# Altium project Torque_sensor.PrjPcb
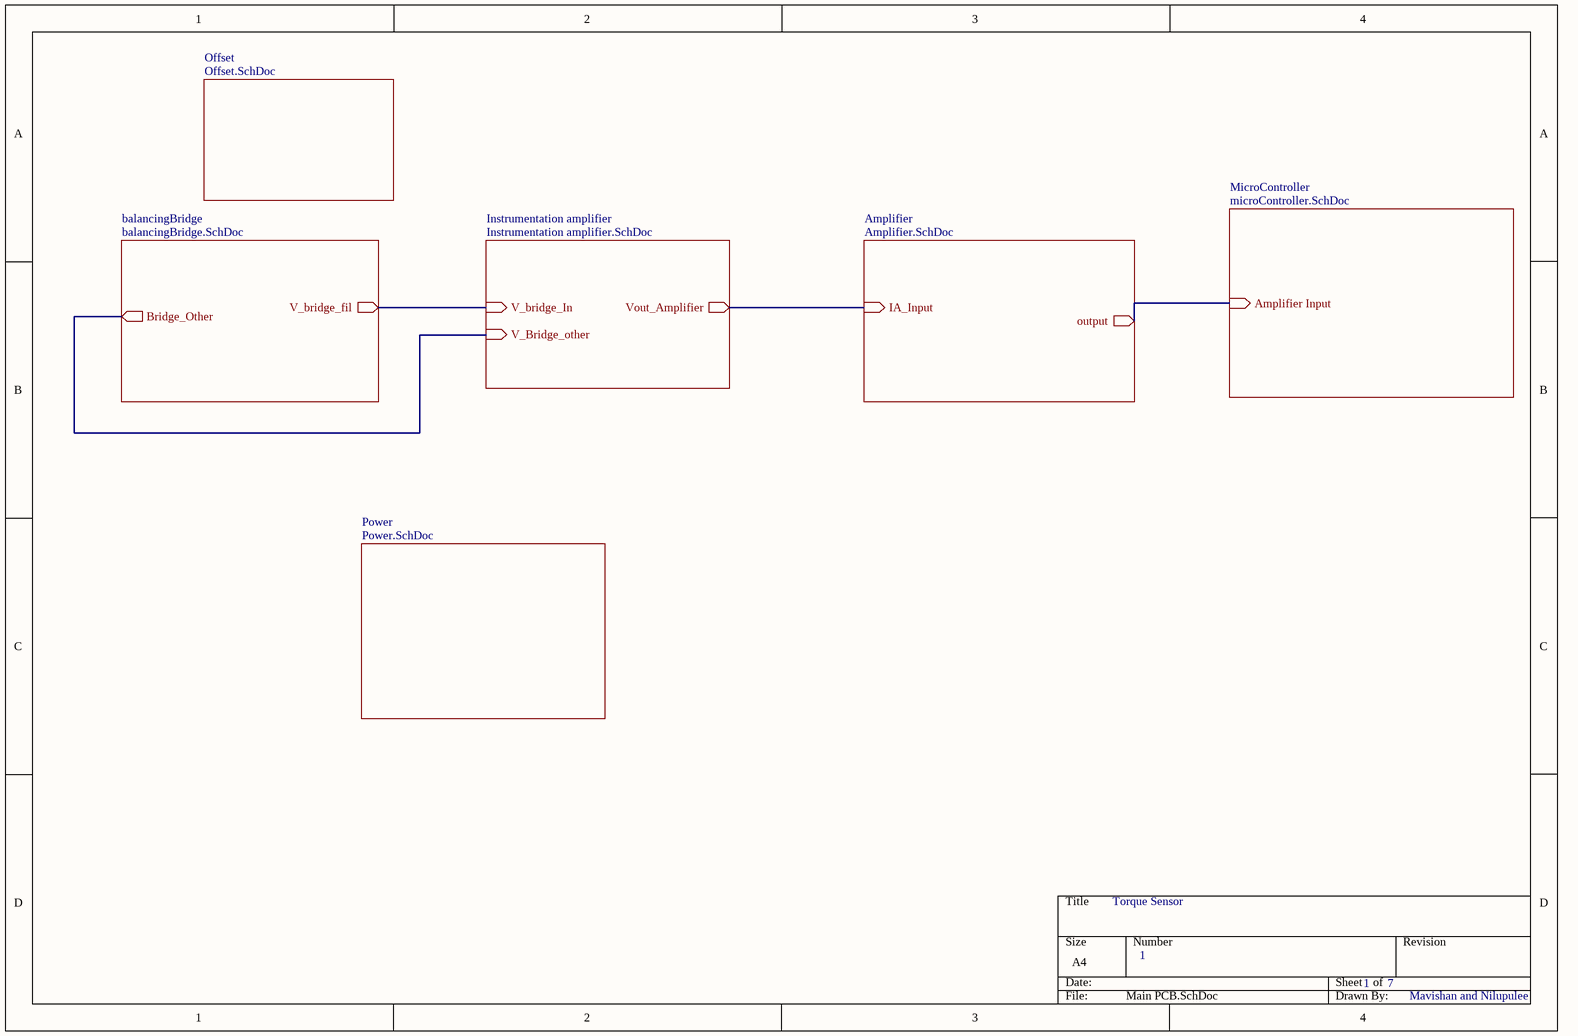
[diagram p0: Main PCB.SchDoc]
7 sheets, 47 parts. Net scope: hierarchical (ports join the sheet entries above them; power ports are global).
Board file: PCB2.PcbDoc
Sheets:
  Main PCB.SchDoc
    balancingBridge = balancingBridge.SchDoc
    Instrumentation amplifier = Instrumentation amplifier.SchDoc
    Amplifier = Amplifier.SchDoc
    MicroController = microController.SchDoc
    Power = Power.SchDoc
    Offset = Offset.SchDoc

## Sheet Main PCB.SchDoc
size A4; SheetNumber: 1; SheetTotal: 7; SPICEModelCacheBXTNJVLD: <root> / <DocumentId>BXTNJVLD</DocumentId> / </root>

### Sub-sheets
Amplifier = Amplifier.SchDoc: IA_Input (in), output (out)
balancingBridge = balancingBridge.SchDoc: V_bridge_fil (out), Bridge_Other (out)
Instrumentation amplifier = Instrumentation amplifier.SchDoc: V_bridge_In (in), Vout_Amplifier (out), V_Bridge_other (in)
MicroController = microController.SchDoc: Amplifier Input (in)
Offset = Offset.SchDoc: no entries
Power = Power.SchDoc: no entries

### Nets
Amplifier Input: sheet Amplifier/output, sheet MicroController/Amplifier Input
Bridge_Other: sheet balancingBridge/Bridge_Other, sheet Instrumentation amplifier/V_Bridge_other
IA_Input: sheet Instrumentation amplifier/Vout_Amplifier, sheet Amplifier/IA_Input
V_bridge_fil: sheet balancingBridge/V_bridge_fil, sheet Instrumentation amplifier/V_bridge_In

### Notes on the sheet
- Torque Sensor
- 1
- 7
- Mavishan and Nilupulee

## Sheet balancingBridge.SchDoc
size A4; SheetNumber: 2; SheetTotal: 7
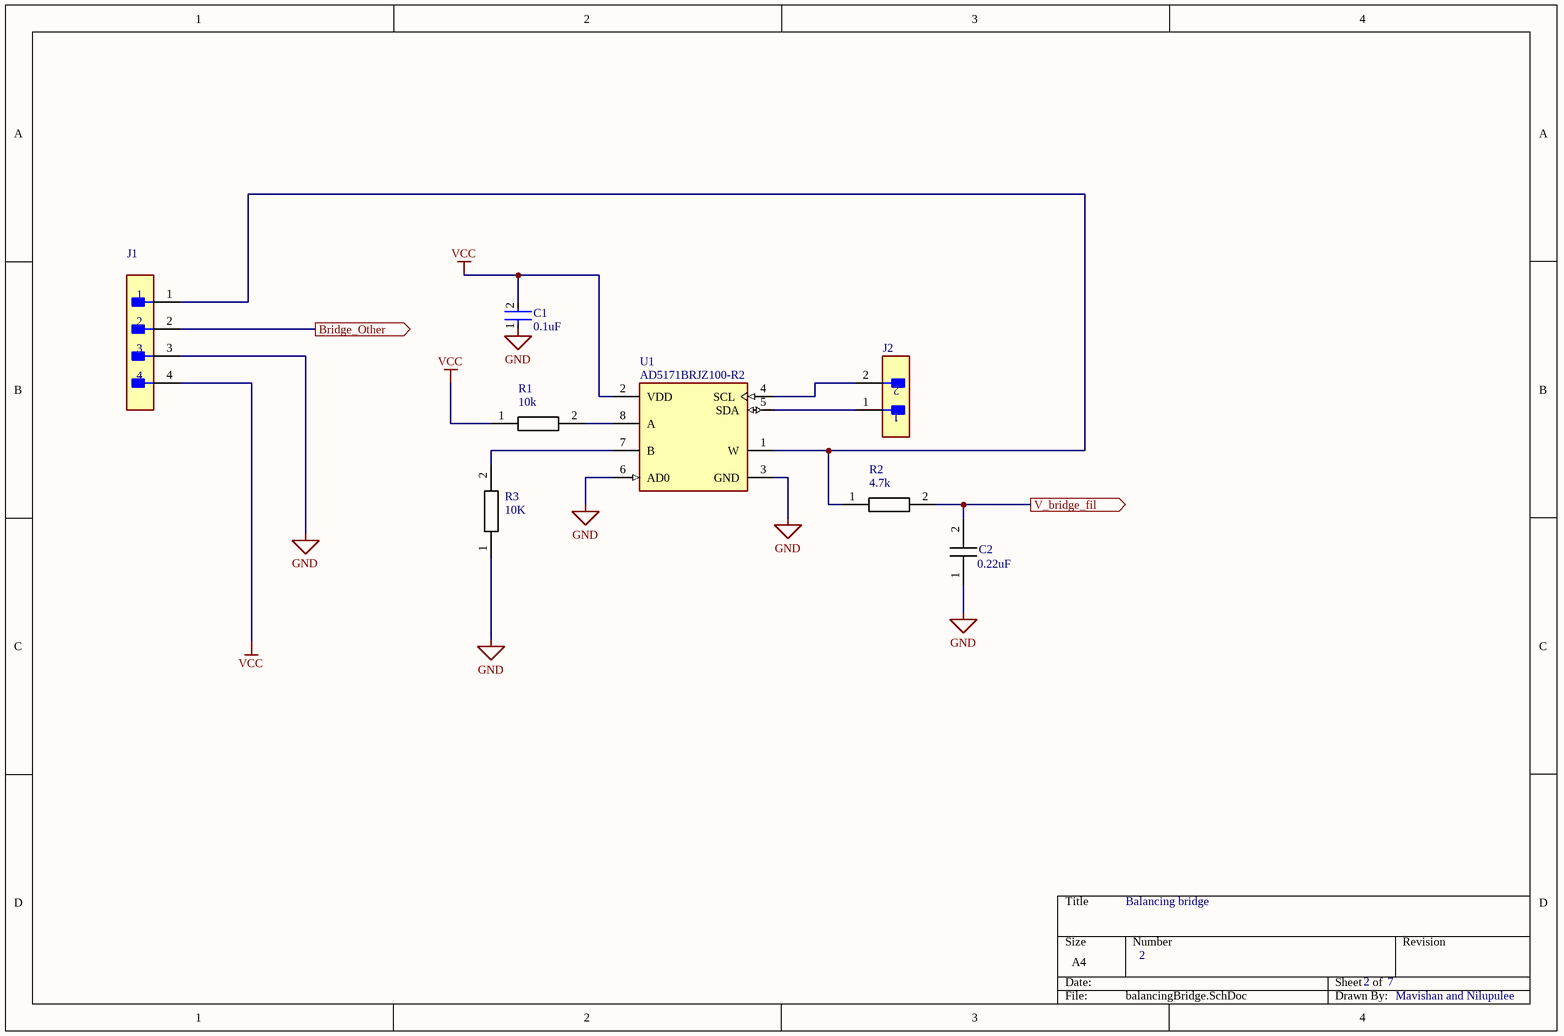
[diagram p1: balancingBridge.SchDoc]

### Parts
C1  0.1uF  [FP-C1206C-EB-MFG]
C2  Parameter 1: 0.22uF  [CAPC3216X94N]  (hidden comment: 12063C224JAT2A)
J1  B4B-XH-A(LF)(SN)  [FP-B4B-XH-A_LF_SN-MFG]  (value not drawn)
J2  M20-9990246  [FP-M20-9990246-MFG]  (value not drawn)
R1  Parameter 1: 10k  [RESC3216X70N]  (hidden comment: ERA-8AEB103V)
R2  Parameter 1: 4.7k  [RESC3116X65N]  (hidden comment: CHP1206AFX-4701ELF)
R3  Parameter 1: 10K  [RESC3216X70N]  (hidden comment: ERA-8AEB103V)
U1  AD5171BRJZ100-R2  [FP-RJ-8-IPC_A]

### Ports
Bridge_Other (out, see Main PCB[2B]), V_bridge_fil (out, see Main PCB[2B])

### Nets
GND: C1.1 C2.1(C1) J1.3 R3.1 U1.3(GND) U1.6(AD0)
VCC: C1.2 J1.4 R1.1 U1.2(VDD)
Bridge_Other: J1.2 ; port Bridge_Other
V_bridge_fil: C2.2(C2) R2.2 ; port V_bridge_fil
NetJ1_1: J1.1 R2.1 U1.1(W)
NetJ2_1: J2.1 U1.5(SDA)
NetJ2_2: J2.2 U1.4(SCL)
NetR1_2: R1.2 U1.8(A)
NetR3_2: R3.2 U1.7(B)

### Notes on the sheet
- Balancing bridge
- 2
- 7
- Mavishan and Nilupulee

### Library data of the parts
C1 = CMP-1037-04186-2: CAP CER 0.1UF 25V C0G/NP0 1206; Manufacturer: KEMET; Manufacturer Part Number: C1206C104F3GACTU; Material: Ceramic; Value: 0.10 μF; Temperature Characteristic: C0G; Temperature Coefficient: 15%; Tolerance: 0.01; Automotive Grade: Grade 0; Device Class L3: Ceramic Capacitors; Voltage Rating: 25 V; Temperature Range Low: -55°C; RoHS: TRUE; Package: C1206C-EB; Category: Cap; Lead Free: Yes; ComponentLink2URL: https://content.kemet.com/datasheets/KEM_C1007_X8R_ULTRA_150C_SMD.pdf; Ipc Land Pattern Name: CAPC320160X78; Temperature Range High: +150°C; Height: 0.88mm; Digikey Description: CAP CER 0.1UF 25V C0G/NP0 1206; ComponentLink2Description: Datasheet; Capacitance: 0.10 μF; Mouser Description: Multilayer Ceramic Capacitors MLCC - SMD/SMT 25volts 0.1uF 1% C0G; Octopart: https://octopart.com/c1206c104f3gactu-kemet-13149870; Device Class L1: Passive Components; Device Class L2: Capacitors; Automotive: Yes; Temperature: -55°C to +150°C
C2 = 12063C224JAT2A: Capacitor; Manufacturer_Name: Kyocera AVX; Manufacturer_Part_Number: 12063C224JAT2A; Mouser Part Number: 581-12063C224JAT2A; Arrow Part Number: 12063C224JAT2A; Arrow Price/Stock: https://www.arrow.com/en/products/12063c224jat2a/avx
J1 = CMP-17439-000250-1: CONN HEADER VERT 4POS 2.5MM; Number of Contacts: 4; Contact Resistance: 20mR; Voltage Rating: 250V; Max Current Rating: 3A; Gender: Male; Wire/Cable Gauge: 22AWG; Mated Stacking Heights: 9.8mm; Insulation Resistance: 1GR; Orientation: Straight; Contact Type: Male Pin; Contact Finish - Mating: TIN; Series: XH; Max Voltage Rating (AC): 250V; Lead Pitch: 2.5mm; Contact Shape: Square; Insulation Color: Natural; Termination: Solder; Lead Free: Lead Free; Voltage Rating (AC): 250V; Number of Rows: 1; Flammability Rating: UL94 V-0; Number of Positions: 4; Max Operating Temperature: 85°C; Package Quantity: 500; Mount: Through Hole; REACH SVHC: No SVHC; Connector Type: Header; Insulation Material: Nylon; Fastening Type: Detent; Min Operating Temperature: -25°C; Housing Color: White; Packaging: Bulk; Contact Plating: Tin; Contact Material: Brass; Max Voltage Rating (DC): 250V; Housing Material: Polyamide; Color: Natural; Material: Polyamide; Pitch: 2.5mm; Depth: 5.75mm; Current Rating: 3A; Length: 12.4mm
J2 = CMP-15831-000009-1: CONN HEADER VERT 2POS 2.54MM; Manufacturer: Harwin; Conn Gender: Male; Conn Orientation: Vertical; Number Of Contacts: 2; Current Rating: 3A; ComponentLink2URL: https://cdn.harwin.com/pdfs/M20-999.pdf; ComponentLink2Description: Datasheet; Package: M20-9990246; Temperature: -40°C to +105°C; Octopart: https://octopart.com/m20-9990246-harwin-2590635; Mouser Description: 2.54mm (0.1") Pitch SIL Vertical PC Tail Pin Header, 6.1mm mating pin height, tin, 2 contacts; Temperature Range High: +105°C; Device Class L1: Connectors; RoHS: TRUE; Automotive: No; Height: 8.99mm; Number Of Rows: 1; Contact Material: Tin,Nickel; Category: Conn; Pitch: 2.54mm; Lead Free: Yes; Digikey Description: CONN HEADER VERT 2POS 2.54MM; Manufacturer Part Number: M20-9990246; Temperature Range Low: -40°C; Device Class L3: unset; Device Class L2: Headers and Wire Housings
R1 R3 = ERA-8AEB103V: Resistor; Manufacturer_Name: Panasonic; Datasheet Link: https://industrial.panasonic.com/cdbs/www-data/pdf/RDM0000/AOA0000C307.pdf; Height: 0.7mm; Manufacturer_Part_Number: ERA-8AEB103V; Mouser Part Number: 667-ERA-8AEB103V; Mouser Price/Stock: https://www.mouser.co.uk/ProductDetail/Panasonic/ERA-8AEB103V?qs=Ojoo2rCVP9QscDrGu5R0Gw%3D%3D; Arrow Part Number: ERA-8AEB103V; Arrow Price/Stock: https://www.arrow.com/en/products/era8aeb103v/panasonic?region=europe
R2 = CHP1206AFX-4701ELF: Resistor; Manufacturer_Name: Bourns; Datasheet Link: https://www.mouser.be/datasheet/2/54/chp-a-1858677.pdf; Height: 0.65mm; Manufacturer_Part_Number: CHP1206AFX-4701ELF; Mouser Part Number: 652-CHP1206AFX-4701L; Mouser Price/Stock: https://www.mouser.co.uk/ProductDetail/Bourns/CHP1206AFX-4701ELF?qs=GedFDFLaBXHtzjpWW2eupA%3D%3D
U1 = CMP-00026-00446399-1: AD5171BRJZ100-R2 Digital Potentiometer 64POS 100kOhm Single Automotive 8-Pin SOT-23 T/R; Manufacturer Lifecycle Status: PRODUCTION; NexarPartId: 446399; -3db Bandwidth: 1.5MHz; Operating Supply Current: 4µA; Temperature Coefficient: 35ppm/°C; Number of Circuits: 1; Tolerance: 30%; Number of Taps: 64; Max Supply Voltage: 5.5V; Interface: I2C; Resistance: 100kΩ; Frequency: 400kHz; Max Junction Temperature (Tj): 150°C; Min Supply Voltage: 2.7V; Memory Type: Non-Volatile, Volatile; Width: 1.6mm; Lead Free: Contains Lead; Case/Package: SOT-23; Quiescent Current: 4µA; RoHS: Compliant; Taper: Linear; Min Operating Temperature: -40°C; Length: 2.9mm; Height: 1.3mm; Lifecycle Status: Production; Packaging: Cut Tape; Number of Pins: 8; REACH SVHC: No SVHC; Contact Plating: Gold; Nominal Supply Current: 4µA; Max Operating Temperature: 125°C; Number of Elements: 1; Mount: Surface Mount; Max Supply Current: 4µA; Schedule B: 8542390000, 8542390000; Number of Positions: 64; Operating Supply Voltage: 5.5V

## Sheet Instrumentation amplifier.SchDoc
size A4; SheetNumber: 3; SheetTotal: 7
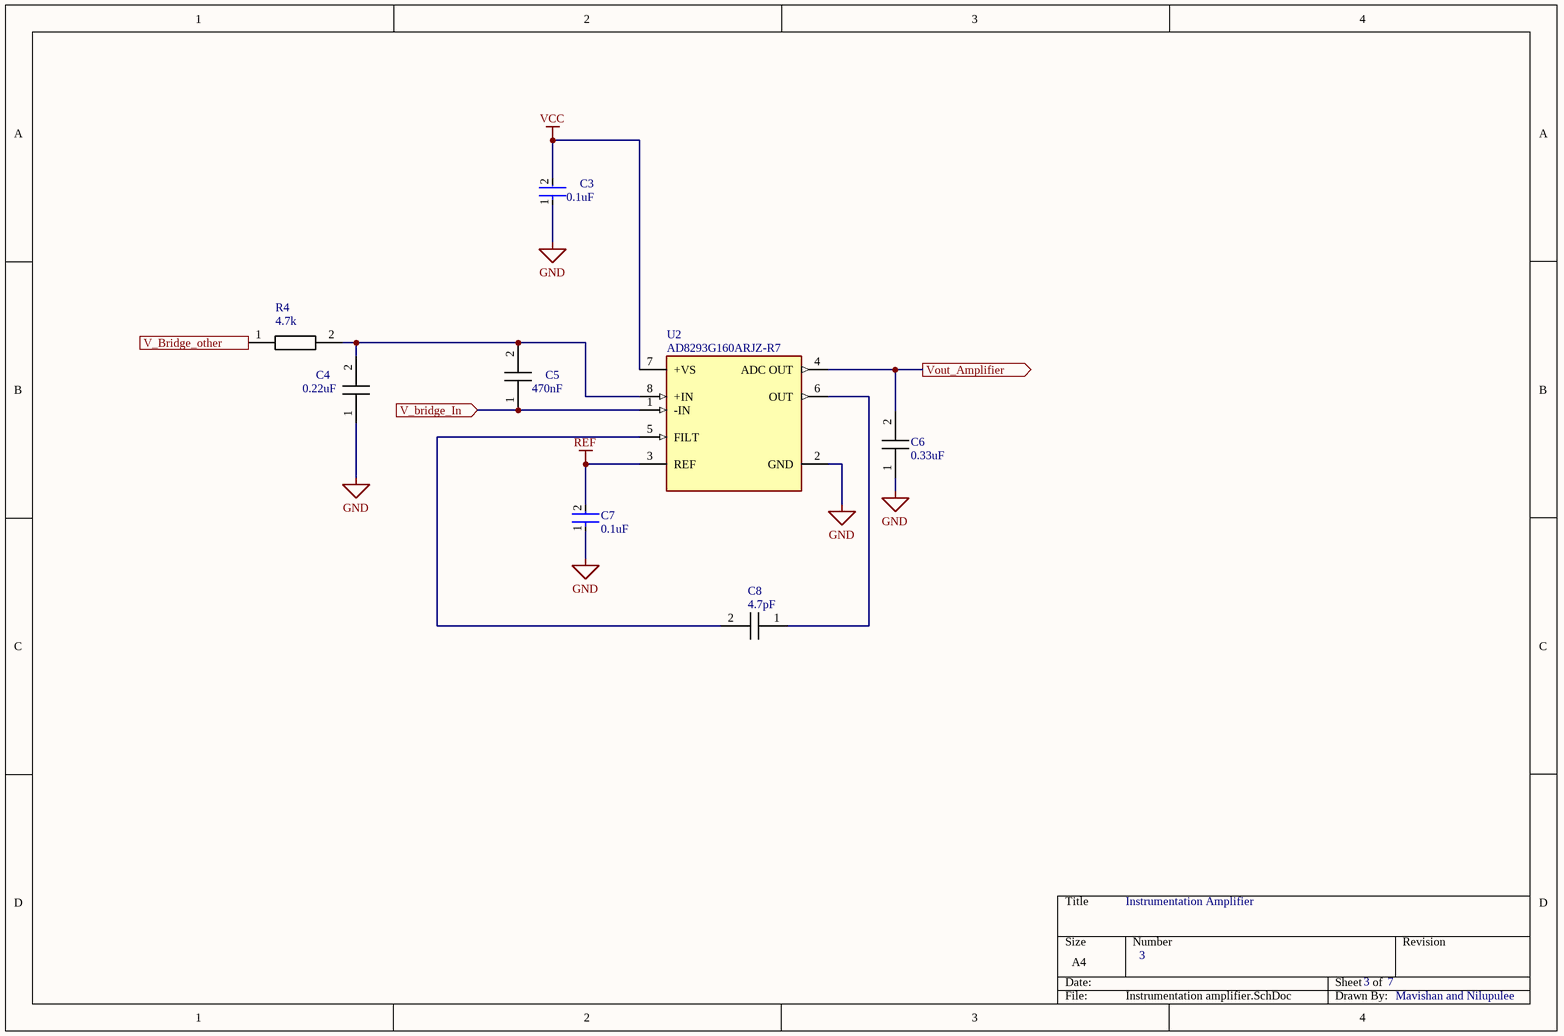
[diagram p2: Instrumentation amplifier.SchDoc]

### Parts
C3  0.1uF  [FP-C1206C-EB-MFG]
C4  Parameter 1: 0.22uF  [CAPC3216X94N]  (hidden comment: 12063C224JAT2A)
C5  Parameter 1: 470nF  [CAPC3216X152N]  (hidden comment: 12065C474JAT2A)
C6  Parameter 1: 0.33uF  [CAPC3216X127N]  (hidden comment: 12063C334MAT2A)
C7  0.1uF  [FP-C1206C-EB-MFG]
C8  Parameter 1: 4.7pF  [CAPC3216X94N]  (hidden comment: 12063A4R7DAT2A)
R4  Parameter 1: 4.7k  [RESC3116X65N]  (hidden comment: CHP1206AFX-4701ELF)
U2  AD8293G160ARJZ-R7  [FP-RJ-8-IPC_B]

### Ports
V_bridge_In (in, see Main PCB[2B]), V_Bridge_other (in, see Main PCB[2B]), Vout_Amplifier (out, see Main PCB[2B])

### Nets
GND: C3.1 C4.1(C1) C6.1(C1) C7.1 U2.2(GND)
REF: C7.2 U2.3(REF)
VCC: C3.2 U2.7(+VS)
Bridge_Other: R4.1 ; port V_Bridge_other
IA_Input: C6.2(C2) U2.4(ADC_OUT) ; port Vout_Amplifier
V_bridge_fil: C5.1 U2.1(-IN) ; port V_bridge_In
NetC4_2: C4.2(C2) C5.2 R4.2 U2.8(+IN)
NetC8_1: C8.1 U2.6(OUT)
NetC8_2: C8.2 U2.5(FILT)

### Notes on the sheet
- Instrumentation Amplifier
- 3
- 7
- Mavishan and Nilupulee

### Library data of the parts
C3 C7 = CMP-1037-04186-2: as C1 on sheet balancingBridge; Device Class L3: Ceramic Capacitors; Voltage Rating: 25 V; Temperature Range Low: -55°C; RoHS: TRUE; Package: C1206C-EB; Category: Cap; Lead Free: Yes; ComponentLink2URL: https://content.kemet.com/datasheets/KEM_C1007_X8R_ULTRA_150C_SMD.pdf; Ipc Land Pattern Name: CAPC320160X78; Temperature Range High: +150°C; Height: 0.88mm; Digikey Description: CAP CER 0.1UF 25V C0G/NP0 1206; ComponentLink2Description: Datasheet; Capacitance: 0.10 μF; Mouser Description: Multilayer Ceramic Capacitors MLCC - SMD/SMT 25volts 0.1uF 1% C0G; Octopart: https://octopart.com/c1206c104f3gactu-kemet-13149870; Device Class L1: Passive Components; Device Class L2: Capacitors; Automotive: Yes; Temperature: -55°C to +150°C
C4 = 12063C224JAT2A: as C2 on sheet balancingBridge; Manufacturer_Part_Number: 12063C224JAT2A; Mouser Part Number: 581-12063C224JAT2A; Arrow Part Number: 12063C224JAT2A; Arrow Price/Stock: https://www.arrow.com/en/products/12063c224jat2a/avx
C5 = 12065C474JAT2A: Capacitor; Manufacturer_Name: Kyocera AVX; Datasheet Link: https://spicat.kyocera-avx.com/product/mlcc/chartview/12065C474JAT2A/DataSheet/X7R; Height: 1.52mm; Manufacturer_Part_Number: 12065C474JAT2A; Mouser Part Number: 581-12065C474J; Mouser Price/Stock: https://www.mouser.co.uk/ProductDetail/AVX/12065C474JAT2A?qs=JKNO%252BtokWhWmgS3PHs6ZAg%3D%3D; as: *
C6 = 12063C334MAT2A: Capacitor; Manufacturer_Name: Kyocera AVX; Manufacturer_Part_Number: 12063C334MAT2A; Mouser Part Number: 581-12063C334MAT2A; Mouser Price/Stock: https://www.mouser.co.uk/ProductDetail/AVX/12063C334MAT2A?qs=UY55afH%252BLTTA4%2F7p5aIkng%3D%3D
C8 = 12063A4R7DAT2A: Capacitor; Manufacturer_Name: Kyocera AVX; Datasheet Link: https://spicat.kyocera-avx.com/product/mlcc/chartview/12063A4R7DAT2A/DataSheet/NP0; Height: 0.94mm; Manufacturer_Part_Number: 12063A4R7DAT2A; Mouser Part Number: 581-12063A4R7DAT2A; Mouser Price/Stock: https://www.mouser.com/Search/Refine.aspx?Keyword=581-12063A4R7DAT2A
R4 = CHP1206AFX-4701ELF: Resistor; Manufacturer_Name: Bourns; Datasheet Link: https://www.mouser.be/datasheet/2/54/chp-a-1858677.pdf; Height: 0.65mm; Manufacturer_Part_Number: CHP1206AFX-4701ELF; Mouser Part Number: 652-CHP1206AFX-4701L; Mouser Price/Stock: https://www.mouser.co.uk/ProductDetail/Bourns/CHP1206AFX-4701ELF?qs=GedFDFLaBXHtzjpWW2eupA%3D%3D
U2 = CMP-09116-000116-1: IC INST AMP 1 CIRCUIT SOT23-8; Output Current per Channel: 35mA; -3db Bandwidth: 500Hz; Max Supply Voltage: 5.5V; Number of Circuits: 1; Input Resistance: 10GR; Power Supply Rejection Ratio (PSRR): 94dB; Input Offset Voltage (Vos): 50uV; Input Bias Current: 2nA; Min Supply Voltage: 1.8V; Amplifier Type: INSTRUMENTATION AMPLIFIER; Common Mode Rejection Ratio: 140dB; Max Supply Current: 1.5mA; Operating Supply Current: 1.3mA; Min Operating Temperature: -40°C; Length: 2.9mm; Packaging: Tape and Reel; Case/Package: SOT; Series: -; Height: 1.3mm; Number of Amplifiers: 1; REACH SVHC: No SVHC; Number of Elements: 1; Lead Free: Contains Lead; Gain Bandwidth Product: 500Hz; Number of Channels: 1; Number of Pins: 8; Mount: Surface Mount; Package Quantity: 3000; Width: 1.6mm; Contact Plating: Gold; RoHS Compliant: Yes; Max Operating Temperature: 85°C

## Sheet Amplifier.SchDoc
size A4; SheetNumber: 4; SheetTotal: 7
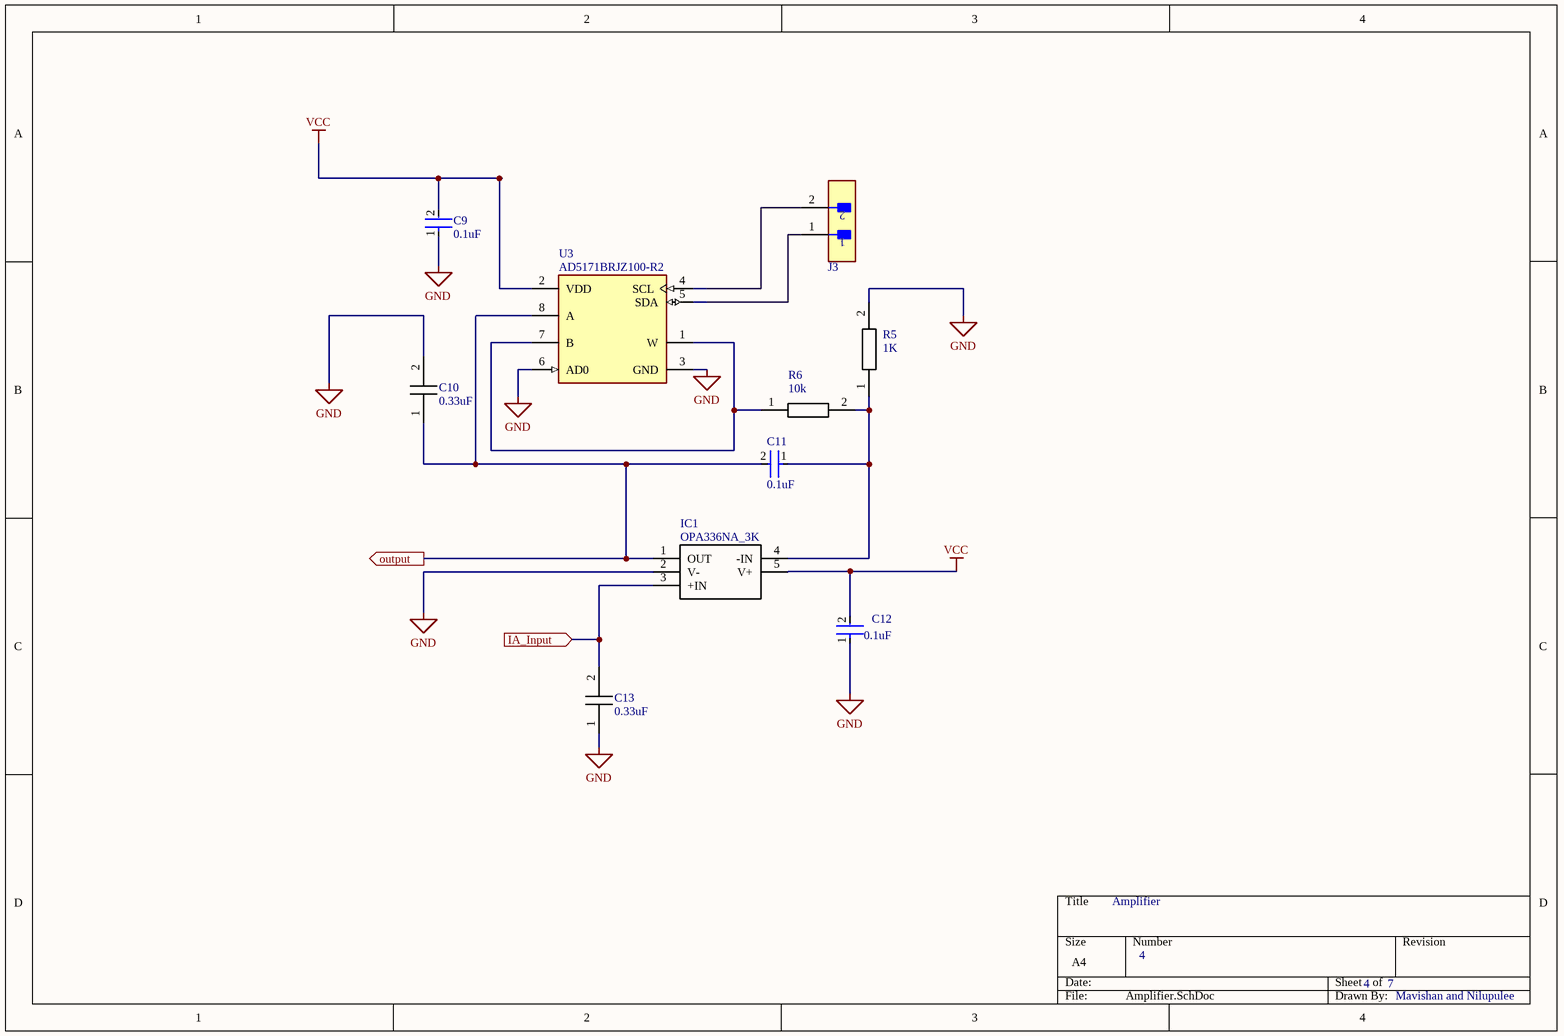
[diagram p3: Amplifier.SchDoc]

### Parts
C9  0.1uF  [FP-C1206C-EB-MFG]
C10  Parameter 1: 0.33uF  [CAPC3216X127N]  (hidden comment: 12063C334MAT2A)
C11  0.1uF  [FP-C1206C-EB-MFG]
C12  0.1uF  [FP-C1206C-EB-MFG]
C13  Parameter 1: 0.33uF  [CAPC3216X127N]  (hidden comment: 12063C334MAT2A)
IC1  OPA336NA_3K  [SOT95P280X145-5N]
J3  M20-9990246  [FP-M20-9990246-MFG]  (value not drawn)
R5  Parameter 1: 1K  [RESC3216X70N]  (hidden comment: ERA8AEB102V)
R6  Parameter 1: 10k  [RESC3216X70N]  (hidden comment: ERA-8AEB103V)
U3  AD5171BRJZ100-R2  [FP-RJ-8-IPC_A]

### Ports
IA_Input (in, see Main PCB[3B]), output (out, see Main PCB[3B])

### Nets
GND: C9.1 C10.2(C2) C12.1 C13.1(C1) IC1.2(V-) R5.2 U3.3(GND) U3.6(AD0)
VCC: C9.2 C12.2 IC1.5(V+) U3.2(VDD)
Amplifier Input: C10.1(C1) C11.2 IC1.1(OUT) U3.8(A) ; port output
IA_Input: C13.2(C2) IC1.3(+IN) ; port IA_Input
NetC11_1: C11.1 IC1.4(-IN) R5.1 R6.2
NetJ3_1: J3.1 U3.5(SDA)
NetJ3_2: J3.2 U3.4(SCL)
NetR6_1: R6.1 U3.1(W) U3.7(B)

### Notes on the sheet
- Amplifier
- 4
- 7
- Mavishan and Nilupulee

### Library data of the parts
C9 C11 C12 = CMP-1037-04186-2: as C1 on sheet balancingBridge; Device Class L3: Ceramic Capacitors; Voltage Rating: 25 V; Temperature Range Low: -55°C; RoHS: TRUE; Package: C1206C-EB; Category: Cap; Lead Free: Yes; ComponentLink2URL: https://content.kemet.com/datasheets/KEM_C1007_X8R_ULTRA_150C_SMD.pdf; Ipc Land Pattern Name: CAPC320160X78; Temperature Range High: +150°C; Height: 0.88mm; Digikey Description: CAP CER 0.1UF 25V C0G/NP0 1206; ComponentLink2Description: Datasheet; Capacitance: 0.10 μF; Mouser Description: Multilayer Ceramic Capacitors MLCC - SMD/SMT 25volts 0.1uF 1% C0G; Octopart: https://octopart.com/c1206c104f3gactu-kemet-13149870; Device Class L1: Passive Components; Device Class L2: Capacitors; Automotive: Yes; Temperature: -55°C to +150°C
C10 C13 = 12063C334MAT2A: as C6 on sheet Instrumentation amplifier; Manufacturer_Part_Number: 12063C334MAT2A; Mouser Part Number: 581-12063C334MAT2A; Mouser Price/Stock: https://www.mouser.co.uk/ProductDetail/AVX/12063C334MAT2A?qs=UY55afH%252BLTTA4%2F7p5aIkng%3D%3D
IC1 = OPA336NA_3K: Integrated Circuit; Manufacturer_Name: Texas Instruments; Manufacturer_Part_Number: OPA336NA/3K; Datasheet Link: http://www.ti.com/lit/gpn/OPA336; Height: 1.45mm; Mouser Part Number: 595-OPA336NA/3K; Mouser Price/Stock: https://www.mouser.co.uk/ProductDetail/Texas-Instruments/OPA336NA-3K?qs=7nS3%252BbEUL6vwF%252Byt2%2F21Rw%3D%3D; Arrow Part Number: OPA336NA/3K; Arrow Price/Stock: https://www.arrow.com/en/products/opa336na3k/texas-instruments?region=nac
J3 = CMP-15831-000009-1: as J2 on sheet balancingBridge; ComponentLink2URL: https://cdn.harwin.com/pdfs/M20-999.pdf; ComponentLink2Description: Datasheet; Package: M20-9990246; Temperature: -40°C to +105°C; Octopart: https://octopart.com/m20-9990246-harwin-2590635; Mouser Description: 2.54mm (0.1") Pitch SIL Vertical PC Tail Pin Header, 6.1mm mating pin height, tin, 2 contacts; Temperature Range High: +105°C; Device Class L1: Connectors; RoHS: TRUE; Automotive: No; Height: 8.99mm; Number Of Rows: 1; Contact Material: Tin,Nickel; Category: Conn; Pitch: 2.54mm; Lead Free: Yes; Digikey Description: CONN HEADER VERT 2POS 2.54MM; Manufacturer Part Number: M20-9990246; Temperature Range Low: -40°C; Device Class L3: unset; Device Class L2: Headers and Wire Housings
R5 = ERA8AEB102V: Resistor; Manufacturer_Name: Panasonic; Datasheet Link: https://industrial.panasonic.com/cdbs/www-data/pdf/RDM0000/AOA0000C307.pdf; Height: 0.7mm; Manufacturer_Part_Number: ERA8AEB102V; Arrow Part Number: ERA8AEB102V; Arrow Price/Stock: https://www.arrow.com/en/products/era-8aeb102v/panasonic
R6 = ERA-8AEB103V: Resistor; Manufacturer_Name: Panasonic; Datasheet Link: https://industrial.panasonic.com/cdbs/www-data/pdf/RDM0000/AOA0000C307.pdf; Height: 0.7mm; Manufacturer_Part_Number: ERA-8AEB103V; Mouser Part Number: 667-ERA-8AEB103V; Mouser Price/Stock: https://www.mouser.co.uk/ProductDetail/Panasonic/ERA-8AEB103V?qs=Ojoo2rCVP9QscDrGu5R0Gw%3D%3D; Arrow Part Number: ERA-8AEB103V; Arrow Price/Stock: https://www.arrow.com/en/products/era8aeb103v/panasonic?region=europe
U3 = CMP-00026-00446399-1: as U1 on sheet balancingBridge; Width: 1.6mm; Lead Free: Contains Lead; Case/Package: SOT-23; Quiescent Current: 4µA; RoHS: Compliant; Taper: Linear; Min Operating Temperature: -40°C; Length: 2.9mm; Height: 1.3mm; Lifecycle Status: Production; Packaging: Cut Tape; Number of Pins: 8; REACH SVHC: No SVHC; Contact Plating: Gold; Nominal Supply Current: 4µA; Max Operating Temperature: 125°C; Number of Elements: 1; Mount: Surface Mount; Max Supply Current: 4µA; Schedule B: 8542390000, 8542390000; Number of Positions: 64; Operating Supply Voltage: 5.5V

## Sheet microController.SchDoc
size A4; SheetNumber: 5; SheetTotal: 7
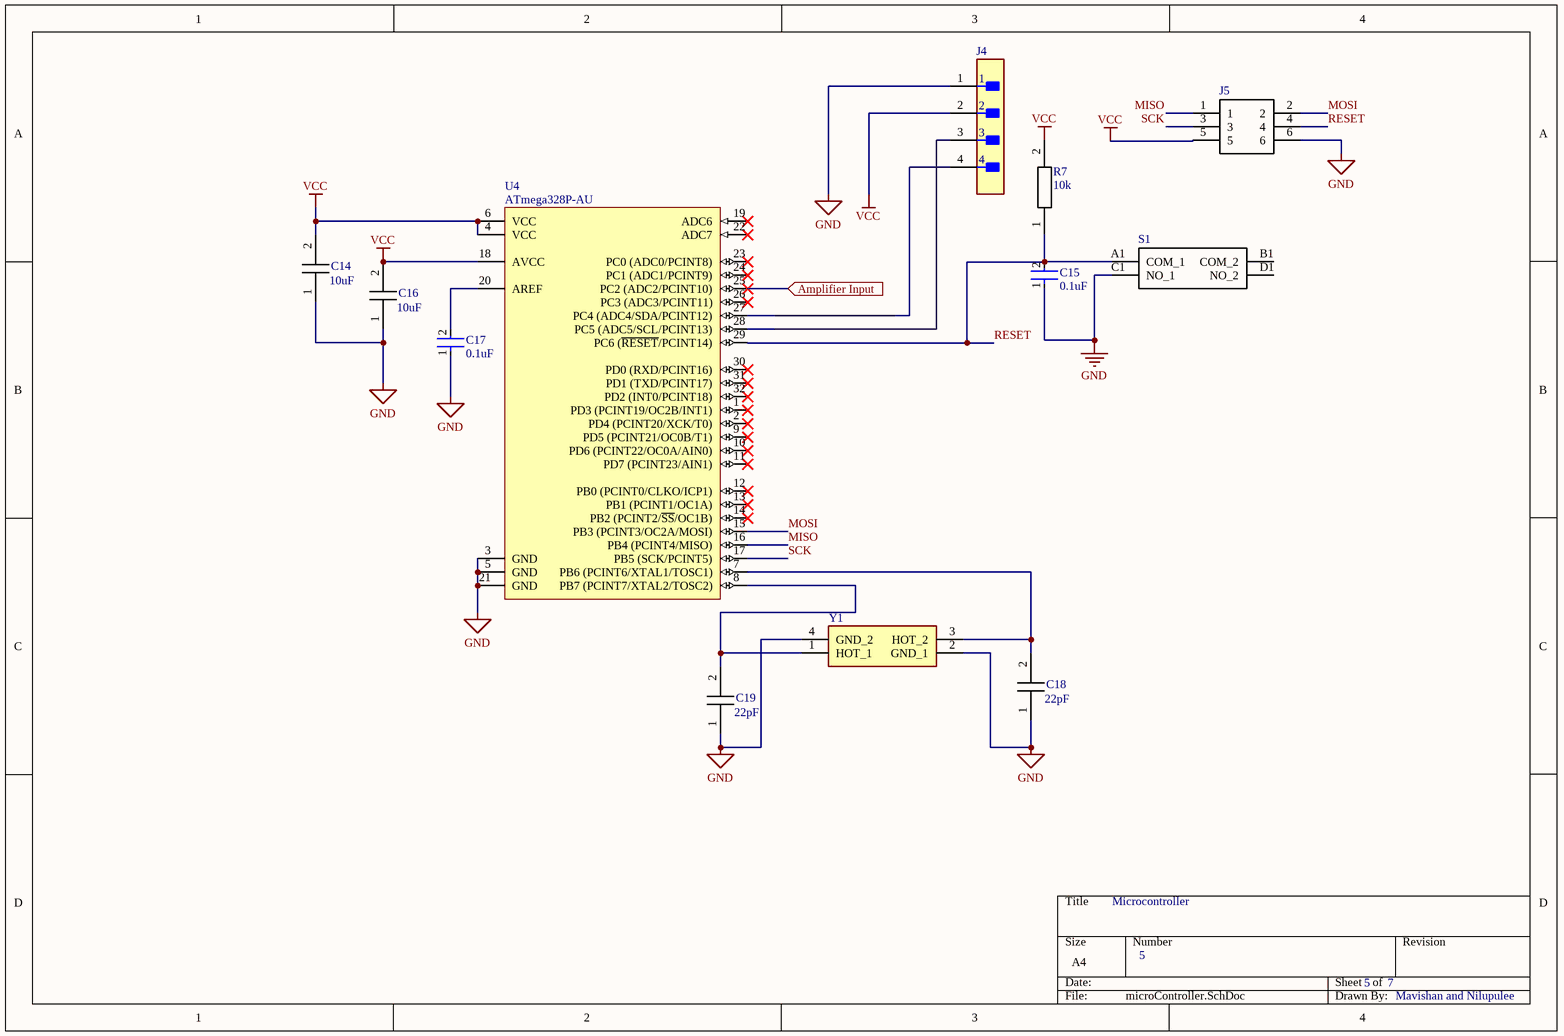
[diagram p4: microController.SchDoc]

### Parts
C14  Parameter 2: 10uF  [CAPC3216X190N]  (hidden comment: CGA5L1X7R1C106K160AC)
C15  0.1uF  [FP-C1206C-EB-MFG]
C16  Parameter 1: 10uF  [CAPC3216X190N]  (hidden comment: CGA5L1X7R1C106K160AC)
C17  0.1uF  [FP-C1206C-EB-MFG]
C18  Parameter 1: 22pF  [CAPC3216X94N]  (hidden comment: 12063A220JAT2A)
C19  Parameter 1: 22pF  [CAPC3216X94N]  (hidden comment: 12063A220JAT2A)
J4  B4B-XH-A(LF)(SN)  [FP-B4B-XH-A_LF_SN-MFG]  (value not drawn)
J5  87914-0606  [HDRV6W69P254_2X3_762X498X859P]  (value not drawn)
R7  Parameter 1: 10k  [RESC3216X70N]  (hidden comment: ERA-8AEB103V)
S1  TS-1187A-B-A-B  [TS1187ABAB]  (value not drawn)
U4  ATmega328P-AU  [32A_M]
Y1  CX3225SA40000D0PTWCC  [CX3225SA40000D0PTWCC]  (value not drawn)

### Ports
Amplifier Input (in, see Main PCB[3C])

### Nets
GND: C14.1 C15.1 C16.1 C17.1 C18.1(C1) C19.1(C1) J4.1 J5.6 S1.C1(NO_1) U4.3(GND) U4.5(GND) U4.21(GND) Y1.2(GND_1) Y1.4(GND_2)
VCC: C14.2 C16.2 J4.2 J5.5 R7.2 U4.4(VCC) U4.6(VCC) U4.18(AVCC)
Amplifier Input: U4.25(PC2_(ADC2/PCINT10)) ; port Amplifier Input
MISO: J5.1 U4.16(PB4_(PCINT4/MISO))
MOSI: J5.2 U4.15(PB3_(PCINT3/OC2A/MOSI))
RESET: C15.2 J5.4 R7.1 S1.A1(COM_1) U4.29(PC6_(~{RESET}/PCINT14))
SCK: J5.3 U4.17(PB5_(SCK/PCINT5))
NetC17_2: C17.2 U4.20(AREF)
NetC18_2: C18.2(C2) U4.7(PB6_(PCINT6/XTAL1/TOSC1)) Y1.3(HOT_2)
NetC19_2: C19.2(C2) U4.8(PB7_(PCINT7/XTAL2/TOSC2)) Y1.1(HOT_1)
NetJ4_3: J4.3 U4.28(PC5_(ADC5/SCL/PCINT13))
NetJ4_4: J4.4 U4.27(PC4_(ADC4/SDA/PCINT12))

Not connected (* = marked no-connect by the designer): S1 B1(COM_2) D1(NO_2); U4 1(PD3_(PCINT19/OC2B/INT1))* 2(PD4_(PCINT20/XCK/T0))* 9(PD5_(PCINT21/OC0B/T1))* 10(PD6_(PCINT22/OC0A/AIN0))* 11(PD7_(PCINT23/AIN1))* 12(PB0_(PCINT0/CLKO/ICP1))* 13(PB1_(PCINT1/OC1A))* 14(PB2_(PCINT2/~{SS}/OC1B))* 19(ADC6)* 22(ADC7)* 23(PC0_(ADC0/PCINT8))* 24(PC1_(ADC1/PCINT9))* 26(PC3_(ADC3/PCINT11))* 30(PD0_(RXD/PCINT16))* 31(PD1_(TXD/PCINT17))* 32(PD2_(INT0/PCINT18))*

### Notes on the sheet
- Microcontroller
- 5
- 7
- Mavishan and Nilupulee

### Library data of the parts
C14 C16 = CGA5L1X7R1C106K160AC: Capacitor; Manufacturer_Name: TDK; Datasheet Link: http://docs-europe.electrocomponents.com/webdocs/14e9/0900766b814e9125.pdf; Height: 1.9mm; Manufacturer_Part_Number: CGA5L1X7R1C106K160AC; Mouser Part Number: 810-CGA5L1X7R1C106KC; Mouser Price/Stock: https://www.mouser.co.uk/ProductDetail/TDK/CGA5L1X7R1C106K160AC?qs=xLDY6iXSiQYs%2FbZYg2RcKQ%3D%3D; Arrow Part Number: CGA5L1X7R1C106K160AC; Arrow Price/Stock: https://www.arrow.com/en/products/cga5l1x7r1c106k160ac/tdk
C15 C17 = CMP-1037-04186-2: as C1 on sheet balancingBridge; Device Class L3: Ceramic Capacitors; Voltage Rating: 25 V; Temperature Range Low: -55°C; RoHS: TRUE; Package: C1206C-EB; Category: Cap; Lead Free: Yes; ComponentLink2URL: https://content.kemet.com/datasheets/KEM_C1007_X8R_ULTRA_150C_SMD.pdf; Ipc Land Pattern Name: CAPC320160X78; Temperature Range High: +150°C; Height: 0.88mm; Digikey Description: CAP CER 0.1UF 25V C0G/NP0 1206; ComponentLink2Description: Datasheet; Capacitance: 0.10 μF; Mouser Description: Multilayer Ceramic Capacitors MLCC - SMD/SMT 25volts 0.1uF 1% C0G; Octopart: https://octopart.com/c1206c104f3gactu-kemet-13149870; Device Class L1: Passive Components; Device Class L2: Capacitors; Automotive: Yes; Temperature: -55°C to +150°C
C18 C19 = 12063A220JAT2A: Capacitor; Manufacturer_Name: Kyocera AVX; Manufacturer_Part_Number: 12063A220JAT2A; Mouser Part Number: 581-12063A220JAT2A; Mouser Price/Stock: https://www.mouser.com/Search/Refine.aspx?Keyword=581-12063A220JAT2A; Arrow Part Number: 12063A220JAT2A; Arrow Price/Stock: https://www.arrow.com/en/products/12063a220jat2a/avx
J4 = CMP-17439-000250-1: as J1 on sheet balancingBridge; Orientation: Straight; Contact Type: Male Pin; Contact Finish - Mating: TIN; Series: XH; Max Voltage Rating (AC): 250V; Lead Pitch: 2.5mm; Contact Shape: Square; Insulation Color: Natural; Termination: Solder; Lead Free: Lead Free; Voltage Rating (AC): 250V; Number of Rows: 1; Flammability Rating: UL94 V-0; Number of Positions: 4; Max Operating Temperature: 85°C; Package Quantity: 500; Mount: Through Hole; REACH SVHC: No SVHC; Connector Type: Header; Insulation Material: Nylon; Fastening Type: Detent; Min Operating Temperature: -25°C; Housing Color: White; Packaging: Bulk; Contact Plating: Tin; Contact Material: Brass; Max Voltage Rating (DC): 250V; Housing Material: Polyamide; Color: Natural; Material: Polyamide; Pitch: 2.5mm; Depth: 5.75mm; Current Rating: 3A; Length: 12.4mm
J5 = 87914-0606: Connector; Manufacturer_Name: Molex; Datasheet Link: https://www.molex.com/content/dam/molex/molex-dot-com/products/automated/en-us/salesdrawingpdf/879/87914/879140606_sd.pdf; Height: 8.59mm; Manufacturer_Part_Number: 87914-0606; Mouser Part Number: 538-87914-0606; Mouser Price/Stock: https://www.mouser.co.uk/ProductDetail/Molex/87914-0606?qs=y2iaK3rfSTnIsAUr2bgTSw%3D%3D
R7 = ERA-8AEB103V: Resistor; Manufacturer_Name: Panasonic; Datasheet Link: https://industrial.panasonic.com/cdbs/www-data/pdf/RDM0000/AOA0000C307.pdf; Height: 0.7mm; Manufacturer_Part_Number: ERA-8AEB103V; Mouser Part Number: 667-ERA-8AEB103V; Mouser Price/Stock: https://www.mouser.co.uk/ProductDetail/Panasonic/ERA-8AEB103V?qs=Ojoo2rCVP9QscDrGu5R0Gw%3D%3D; Arrow Part Number: ERA-8AEB103V; Arrow Price/Stock: https://www.arrow.com/en/products/era8aeb103v/panasonic?region=europe
S1 = TS-1187A-B-A-B: Switch; Manufacturer_Name: XKB Connectivity; Datasheet Link: http://www.helloxkb.com/public/images/pdf/TS-1187A-X-X-X.pdf; Height: 4.05mm; Manufacturer_Part_Number: TS-1187A-B-A-B
U4 = CMP-0095-00269-2: 8-bit AVR Microcontroller, 32KB Flash, 1KB EEPROM, 2KB SRAM, 32-pin TQFP, Industrial Grade (-40°C to 85°C); PackageDescription: 32-Lead, 7x7x1.0 mm Body, 0.8mm Lead Pitch, Thin Profile Plastic Quad Flat Package (TQFP); DatasheetVersion: revD, May-2011; RevisionNote: DatasheetVersion & PackageVersion updated. URLs added.; ComponentLink1URL: http://www.atmel.com/; ComponentLink2Description: ATmega48A/48PA/88A/88PA/168A/168PA/328/328P Datasheet; Code_JEDEC: MS-026-ABA; ComponentLink1Description: Manufacturer URL; PackageReference: 32A; ComponentLink3Description: ATmega48A/48PA/88A/88PA/168A/168PA/328/328P Summary; ComponentLink2URL: http://www.atmel.com/dyn/resources/prod_documents/doc8271.pdf; PackageVersion: revC, Oct-2010; ComponentLink3URL: http://www.atmel.com/dyn/resources/prod_documents/8271S.pdf
Y1 = CX3225SA40000D0PTWCC: Crystal or Oscillator; Manufacturer_Name: KYOCERA; Datasheet Link: https://media.digikey.com/pdf/Data%20Sheets/Kyocera%20International/CX3225SA40000D0PTWCC_DS.pdf; Height: 0.8mm; Manufacturer_Part_Number: CX3225SA40000D0PTWCC; Mouser Part Number: 581-CX3225SA40D0PTWC; Mouser Price/Stock: https://www.mouser.co.uk/ProductDetail/KYOCERA-AVX/CX3225SA40000D0PTWCC?qs=HuCFcgRyUKhyUGYK%2FnO9Bw%3D%3D; Arrow Part Number: CX3225SA40000D0PTWCC; Arrow Price/Stock: https://www.arrow.com/en/products/cx3225sa40000d0ptwcc/kyocera

## Sheet Power.SchDoc
size A4; SheetNumber: 6; SheetTotal: 7
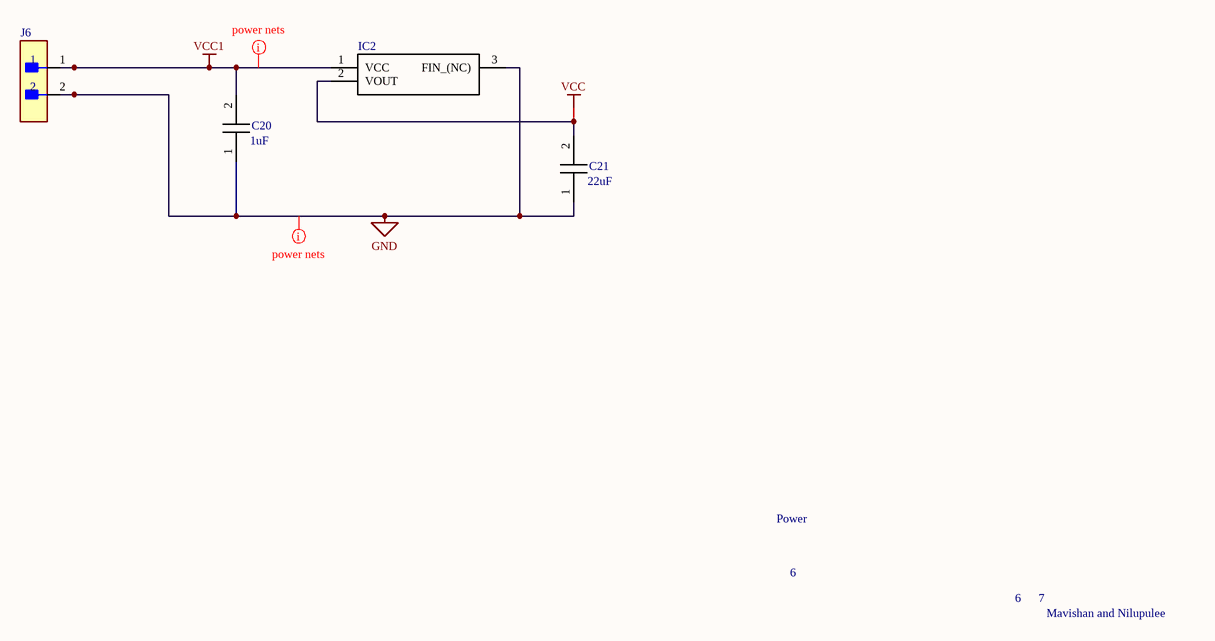
[diagram p5: Power.SchDoc]

### Parts
C20  Parameter 1: 1uF  [CAPC3216X178N]  (hidden comment: 12063C105MAT2A)
C21  Parameter 1: 22uF  [CAPC3216X229N]  (hidden comment: 12063D226MAT2A)
IC2  BD450M5FP-CE2  [ROHM_TO-252-3]  (value not drawn)
J6  B2B-XH-A(LF)(SN)  [FP-B2B-XH-A_LF_SN-MFG]  (value not drawn)

### Nets
GND: C20.1 C21.1 IC2.3(FIN_(NC)) J6.2
VCC: C21.2 IC2.2(VOUT)
VCC1: C20.2 IC2.1(VCC) J6.1

### Layout directives
net class name: PowerNets; net class PowerNets: GND, VCC1

### Notes on the sheet
- Power
- 6
- 7
- Mavishan and Nilupulee

### Library data of the parts
C20 = 12063C105MAT2A: Capacitor; Manufacturer_Name: Kyocera AVX; Datasheet Link: https://spicat.kyocera-avx.com/product/mlcc/chartview/12063C105MAT2A/DataSheet/X7R; Height: 1.78mm; Manufacturer_Part_Number: 12063C105MAT2A; Mouser Part Number: 581-12063C105MAT2A; Mouser Price/Stock: https://www.mouser.com/Search/Refine.aspx?Keyword=581-12063C105MAT2A; Arrow Part Number: 12063C105MAT2A; Arrow Price/Stock: https://www.arrow.com/en/products/12063c105mat2a/avx
C21 = 12063D226MAT2A: Capacitor; Manufacturer_Name: Kyocera AVX; Datasheet Link: https://rs.componentsearchengine.com/Datasheets/1/12063D226MAT2A.pdf; Height: 2.29mm; Manufacturer_Part_Number: 12063D226MAT2A; Mouser Part Number: 581-12063D226MAT2A; Mouser Price/Stock: https://www.mouser.co.uk/ProductDetail/KYOCERA-AVX/12063D226MAT2A?qs=q%252BHV0zBR8MiKBGAgbZK5Jw%3D%3D; Arrow Part Number: 12063D226MAT2A; Arrow Price/Stock: https://www.arrow.com/en/products/12063d226mat2a/avx?region=nac
IC2 = BD450M5FP-CE2: Integrated Circuit; Manufacturer_Name: ROHM Semiconductor; Datasheet Link: https://datasheet.datasheetarchive.com/originals/distributors/DKDS-10/186386.pdf; Manufacturer_Part_Number: BD450M5FP-CE2; Mouser Part Number: 755-BD450M5FP-CE2; Mouser Price/Stock: https://www.mouser.co.uk/ProductDetail/ROHM-Semiconductor/BD450M5FP-CE2?qs=zGux8KhMp6L1UcqyCxjOAw%3D%3D
J6 = CMP-2000-05888-3: CONN HEADER VERT 2POS 2.5MM; Current Rating: 3A; Voltage Rating: 250V; Number of Contacts: 2; Contact Resistance: 20mR; Wire/Cable Gauge: 22AWG; Insulation Resistance: 1GR; Connector Type: Male Pin; Packaging: Bulk; Contact Material: Brass; Lead Free: Lead Free; Orientation: Straight; Contact Plating: Tin; Max Current Rating: 3A; Termination: Solder; Fastening Type: Detent; Depth: 5.75mm; Housing Material: Polyamide; REACH SVHC: No SVHC; Series: XH; Voltage Rating (AC): 250V; Number of Positions: 2; Color: Natural; Contact Type: Male Pin; Max Voltage Rating (DC): 250V; Pitch: 2.5mm; Lead Pitch: 2.5mm; Mount: Through Hole; Max Operating Temperature: 85°C; Length: 7.4mm; Max Voltage Rating (AC): 250V; Min Operating Temperature: -25°C; Number of Rows: 1; Housing Color: White

## Sheet Offset.SchDoc
size A4; SheetNumber: 7; SheetTotal: 7
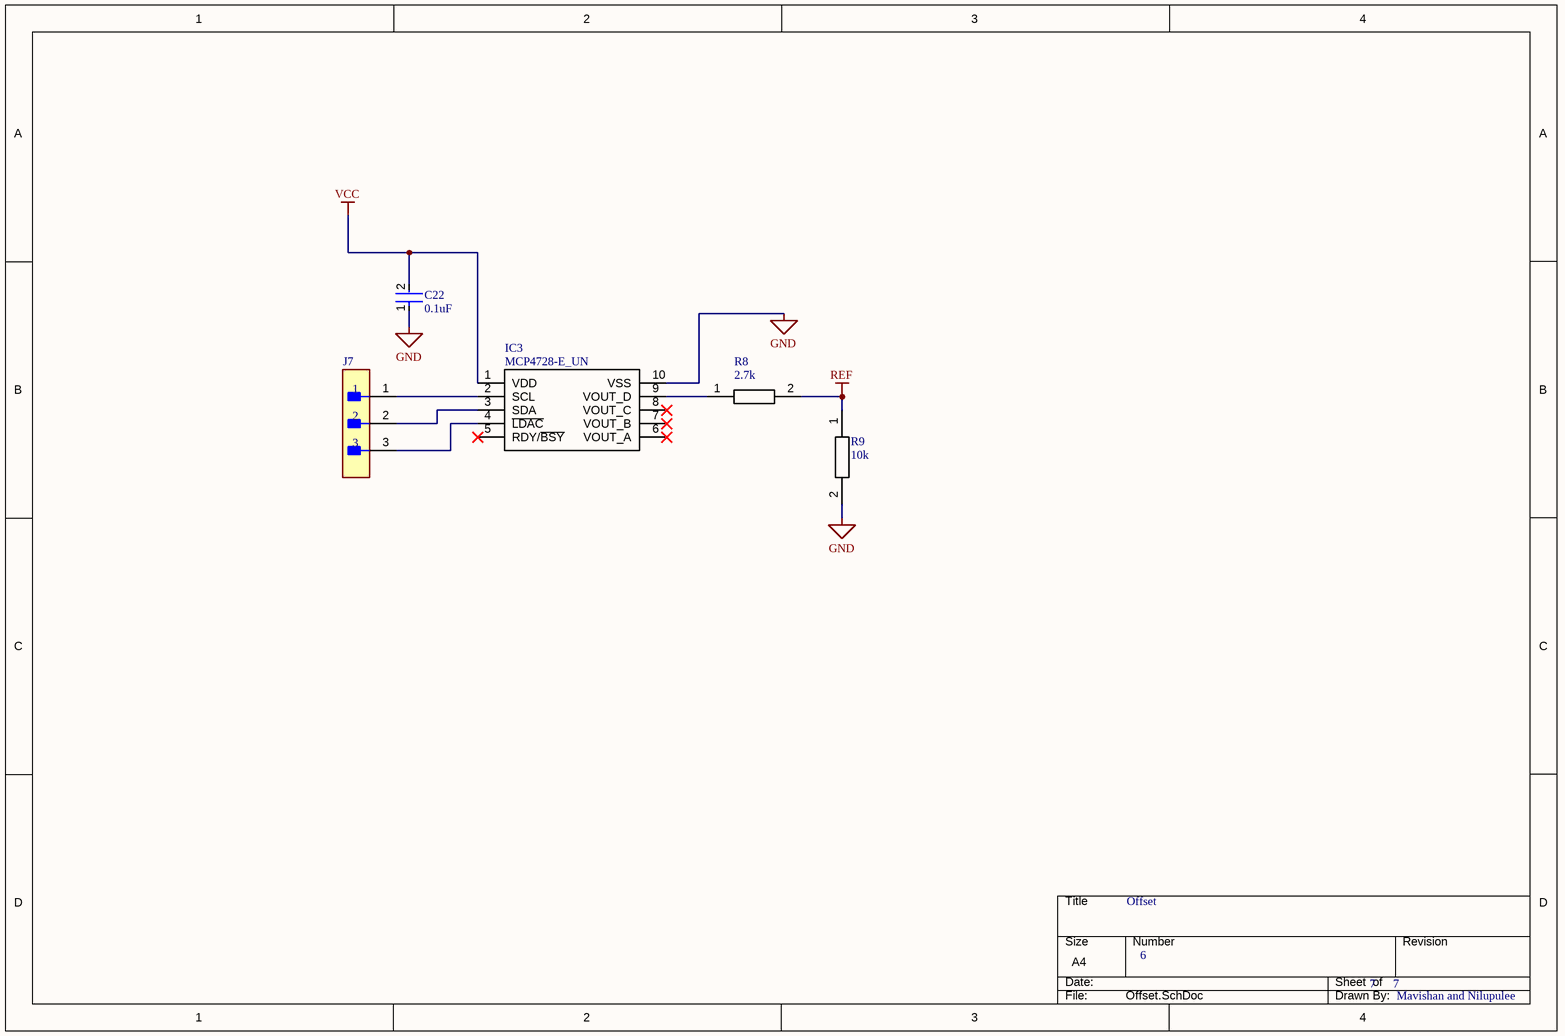
[diagram p6: Offset.SchDoc]

### Parts
C22  0.1uF  [FP-C1206C-EB-MFG]
IC3  MCP4728-E_UN  [SOP50P490X110-10N]
J7  B3B-XH-A(LF)(SN)  [FP-B3B-XH-A_LF_SN-MFG]  (value not drawn)
R8  Parameter 1: 2.7k  [RESC3216X70N]  (hidden comment: ERA-8AEB272V)
R9  Parameter 1: 10k  [RESC3216X70N]  (hidden comment: ERA-8AEB103V)

### Nets
GND: C22.1 IC3.10(VSS) R9.2
REF: R8.2 R9.1
VCC: C22.2 IC3.1(VDD)
NetIC3_2: IC3.2(SCL) J7.1
NetIC3_3: IC3.3(SDA) J7.2
NetIC3_4: IC3.4(~{LDAC}) J7.3
NetIC3_9: IC3.9(VOUT_D) R8.1

Not connected (* = marked no-connect by the designer): IC3 5(RDY/~{BSY})* 6(VOUT_A)* 7(VOUT_B)* 8(VOUT_C)*

### Notes on the sheet
- Offset
- 6
- 7
- Mavishan and Nilupulee
- THIS DOCUMENT AND THE DATA DISCLOSED HEREIN OR
- HEREWITH IS THE PROPERTY OF ALTIUM LIMITED AND MAY
- DWG NO:
- REVISION
- REV:
- DESCRIPTION
- DATE
- APPROVED
- BE FREELY DISTRIBUTED IN WHOLE. NO RIGHTS ARE
- RESERVED OR EXPRESS OR IMPLIED WARANTEE GIVEN.
- ENG:
- APPROVALS
- PROJECT
- DSN:
- CHK:
- REFERENCE DOCUMENTS
- PROJECT REVISION:
- TITLE
- DOCUMENT REVISION:
- DESIGN ITEM:
- BOM:
- FAB DWG:
- PCB DWG:
- ASSY DWG:
- SCALE:
- A3
- SIZE
- CAGE CODE
- FILE NAME
- DWG NO.
- SHEET
- OF
- REV

### Library data of the parts
C22 = CMP-1037-04186-2: as C1 on sheet balancingBridge; Device Class L3: Ceramic Capacitors; Voltage Rating: 25 V; Temperature Range Low: -55°C; RoHS: TRUE; Package: C1206C-EB; Category: Cap; Lead Free: Yes; ComponentLink2URL: https://content.kemet.com/datasheets/KEM_C1007_X8R_ULTRA_150C_SMD.pdf; Ipc Land Pattern Name: CAPC320160X78; Temperature Range High: +150°C; Height: 0.88mm; Digikey Description: CAP CER 0.1UF 25V C0G/NP0 1206; ComponentLink2Description: Datasheet; Capacitance: 0.10 μF; Mouser Description: Multilayer Ceramic Capacitors MLCC - SMD/SMT 25volts 0.1uF 1% C0G; Octopart: https://octopart.com/c1206c104f3gactu-kemet-13149870; Device Class L1: Passive Components; Device Class L2: Capacitors; Automotive: Yes; Temperature: -55°C to +150°C
IC3 = MCP4728-E_UN: Integrated Circuit; Manufacturer_Name: Microchip; Manufacturer_Part_Number: MCP4728-E/UN; Datasheet Link: http://ww1.microchip.com/downloads/en/DeviceDoc/22187E.pdf; Height: 1.1mm; Mouser Part Number: 579-MCP4728-E/UN; Mouser Price/Stock: https://www.mouser.co.uk/ProductDetail/Microchip-Technology/MCP4728-E-UN?qs=E6wAi2XWqcP2zTenScklGA%3D%3D; Arrow Part Number: MCP4728-E/UN; Arrow Price/Stock: https://www.arrow.com/en/products/mcp4728-eun/microchip-technology?region=nac
J7 = CMP-17439-000014-3: CONN HEADER VERT 3POS 2.5MM; Max Voltage Rating (DC): 250V; Number of Positions: 3; Current Rating: 3A; Gender: Male; Wire/Cable Gauge: 22AWG; Contact Resistance: 20mR; Insulation Resistance: 1GR; Insulation Material: Nylon; Contact Plating: Tin; Depth: 5.75mm; Contact Type: Male Pin; Max Operating Temperature: 85°C; Insulation Color: Natural; Voltage Rating (AC): 250V; Color: Natural; Connector Type: Header; Orientation: Straight; Fastening Type: Detent; Housing Color: White; Min Operating Temperature: -25°C; Termination: Solder; Voltage Rating: 250V; Series: XH; Pitch: 2.5mm; Contact Shape: Square; Number of Rows: 1; Lead Free: Lead Free; Packaging: Bulk; Mount: Through Hole; Flammability Rating: UL94 V-0; Max Voltage Rating (AC): 250V; REACH SVHC: No SVHC; Housing Material: Polyamide; Contact Material: Brass; Lead Pitch: 2.5mm; Contact Finish - Mating: TIN; Length: 9.9mm; Max Current Rating: 3A; Number of Contacts: 3
R8 = ERA-8AEB272V: Resistor; Manufacturer_Name: Panasonic; Datasheet Link: https://industrial.panasonic.com/cdbs/www-data/pdf/RDM0000/AOA0000C307.pdf; Height: 0.7mm; Manufacturer_Part_Number: ERA-8AEB272V; Mouser Part Number: 667-ERA-8AEB272V; Mouser Price/Stock: https://www.mouser.com/Search/Refine.aspx?Keyword=667-ERA-8AEB272V
R9 = ERA-8AEB103V: Resistor; Manufacturer_Name: Panasonic; Datasheet Link: https://industrial.panasonic.com/cdbs/www-data/pdf/RDM0000/AOA0000C307.pdf; Height: 0.7mm; Manufacturer_Part_Number: ERA-8AEB103V; Mouser Part Number: 667-ERA-8AEB103V; Mouser Price/Stock: https://www.mouser.co.uk/ProductDetail/Panasonic/ERA-8AEB103V?qs=Ojoo2rCVP9QscDrGu5R0Gw%3D%3D; Arrow Part Number: ERA-8AEB103V; Arrow Price/Stock: https://www.arrow.com/en/products/era8aeb103v/panasonic?region=europe

## Nets that join several sheets
GND: balancingBridge (6 pins), Instrumentation amplifier (5 pins), Amplifier (8 pins), microController (14 pins), Power (C20.1 C21.1 IC2.3 J6.2), Offset (C22.1 IC3.10 R9.2)
REF: Instrumentation amplifier (C7.2 U2.3), Offset (R8.2 R9.1)
VCC: balancingBridge (C1.2 J1.4 R1.1 U1.2), Instrumentation amplifier (C3.2 U2.7), Amplifier (C9.2 C12.2 IC1.5 U3.2), microController (8 pins), Power (C21.2 IC2.2), Offset (C22.2 IC3.1)
Amplifier Input: Amplifier (C10.1 C11.2 IC1.1 U3.8), microController (U4.25)
Bridge_Other: balancingBridge (J1.2), Instrumentation amplifier (R4.1)
IA_Input: Instrumentation amplifier (C6.2 U2.4), Amplifier (C13.2 IC1.3)
V_bridge_fil: balancingBridge (C2.2 R2.2), Instrumentation amplifier (C5.1 U2.1)